# EAGLE schematic PCA9685Shield (EAGLE 7.4.0)
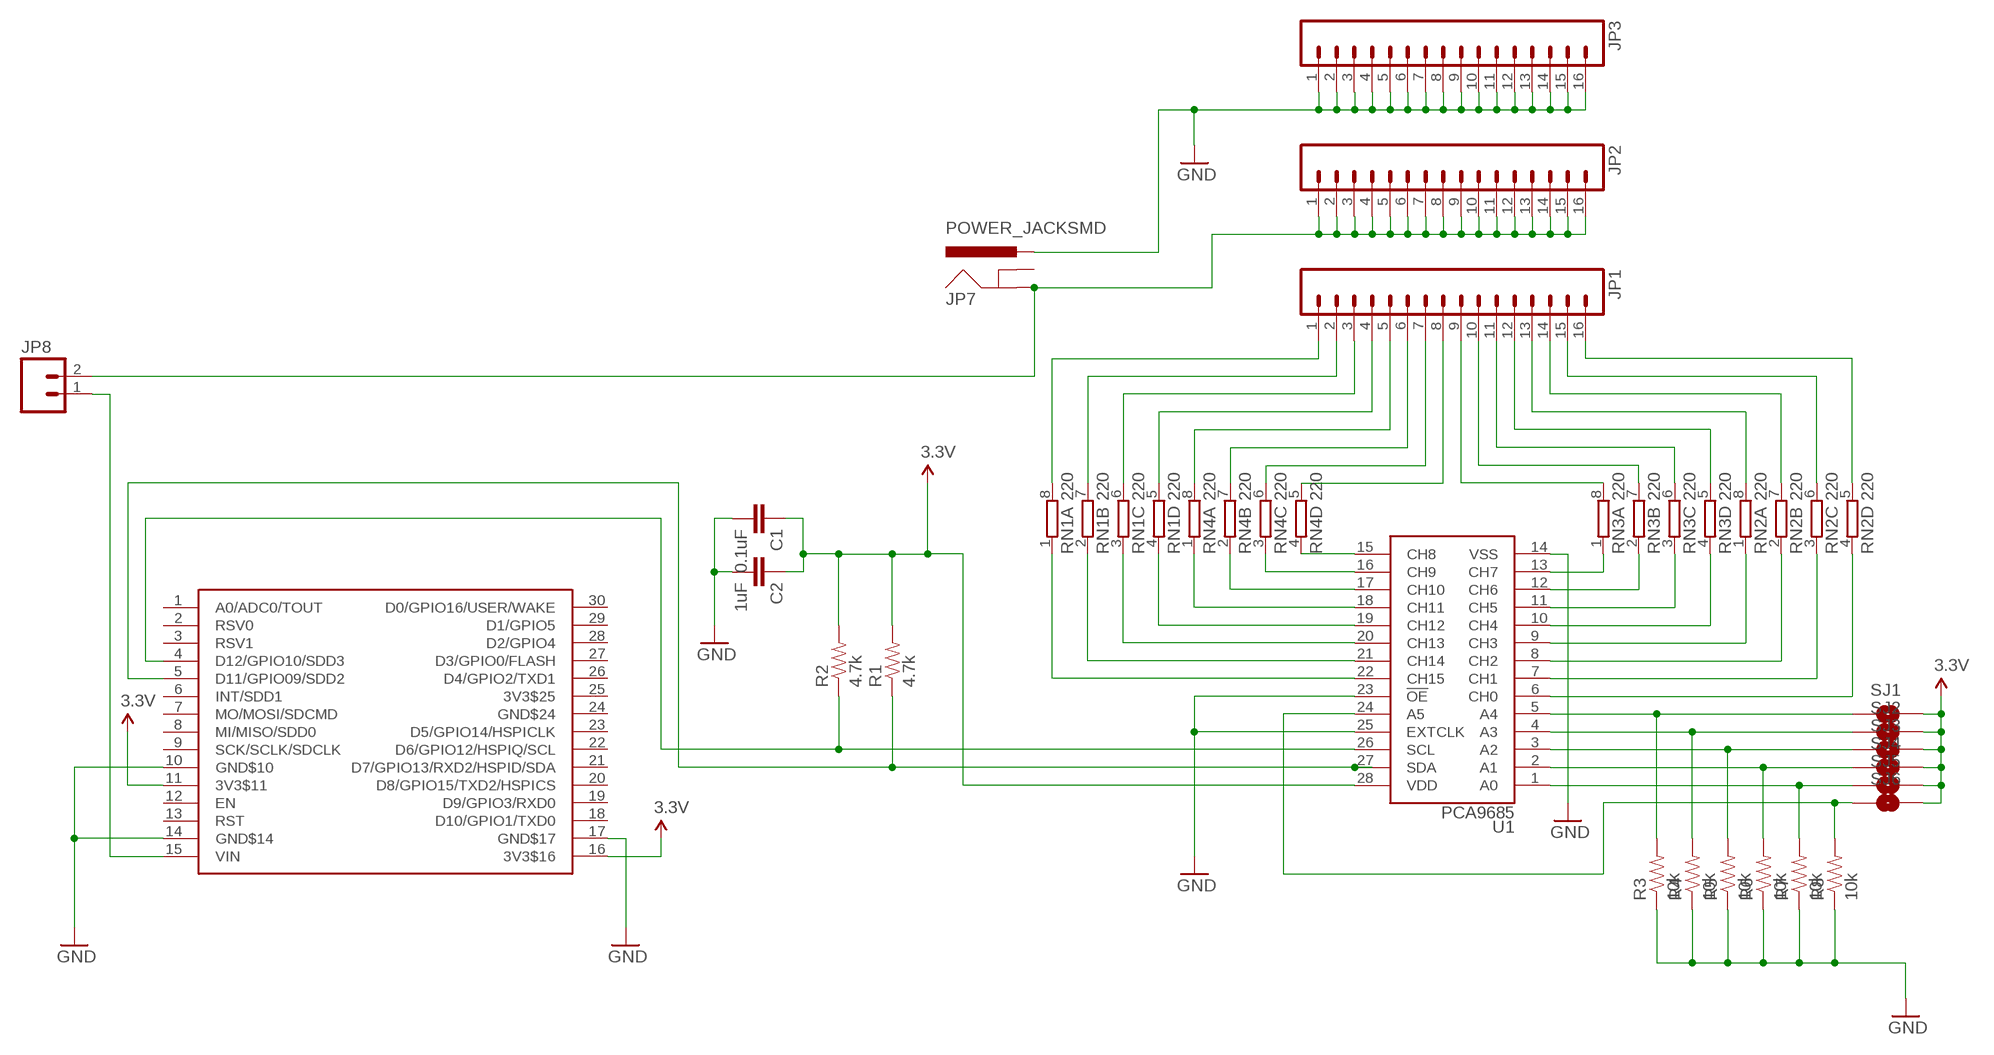
[diagram p0: schematic, sheet 1]

## Parts
C1  0.1uF  CAP0402-CAP  [0402-CAP]
C2  1uF  CAP0402-CAP  [0402-CAP]
JP1  M161X16_NO_SILK  [1X16_NO_SILK]
JP2  M161X16_NO_SILK  [1X16_NO_SILK]
JP3  M161X16_NO_SILK  [1X16_NO_SILK]
JP7  POWER_JACKSMD  [POWER_JACK_SMD]
JP8  M021X02_NO_SILK  [1X02_NO_SILK]
R1  4.7k  RESISTOR0402-RES  [0402-RES]
R2  4.7k  RESISTOR0402-RES  [0402-RES]
R3  10k  RESISTOR0402-RES  [0402-RES]
R4  10k  RESISTOR0402-RES  [0402-RES]
R5  10k  RESISTOR0402-RES  [0402-RES]
R6  10k  RESISTOR0402-RES  [0402-RES]
R7  10k  RESISTOR0402-RES  [0402-RES]
R8  10k  RESISTOR0402-RES  [0402-RES]
RN1  220  4R-NEXBS8V  [EXBS8V]
RN2  220  4R-NEXBS8V  [EXBS8V]
RN3  220  4R-NEXBS8V  [EXBS8V]
RN4  220  4R-NEXBS8V  [EXBS8V]
SJ1  SOLDERJUMPERNO  [SJ_2S-NO]
SJ2  SOLDERJUMPERNO  [SJ_2S-NO]
SJ3  SOLDERJUMPERNO  [SJ_2S-NO]
SJ4  SOLDERJUMPERNO  [SJ_2S-NO]
SJ5  SOLDERJUMPERNO  [SJ_2S-NO]
SJ6  SOLDERJUMPERNO  [SJ_2S-NO]
U1  PCA9685  [TSSOP-28_4MM]
U$1  NERDSHIELD  [NERDUINO_STACK]

## Nets
3.3V: C1.1 C2.1 R1.2 R2.2 SJ1.2 SJ2.2 SJ3.2 SJ4.2 SJ5.2 SJ6.2 U1.28(VDD) U$1.11(3V3$11) U$1.16(3V3$16)
GND: C1.2 C2.2 JP3.1 JP3.2 JP3.3 JP3.4 JP3.5 JP3.6 JP3.7 JP3.8 JP3.9 JP3.10 JP3.11 JP3.12 JP3.13 JP3.14 JP3.15 JP3.16 JP7.VIN0(PWR) R3.1 R4.1 R5.1 R6.1 R7.1 R8.1 U1.14(VSS) U1.23(!OE) U1.25(EXTCLK) U$1.10(GND$10) U$1.14(GND$14) U$1.17(GND$17)
N$1: JP8.1 U$1.15(VIN)
N$2: R1.1 U1.27(SDA) U$1.5(D11/GPIO09/SDD2)
N$3: R7.2 SJ5.1 U1.1(A0)
N$4: R6.2 SJ4.1 U1.2(A1)
N$5: R5.2 SJ3.1 U1.3(A2)
N$6: R4.2 SJ2.1 U1.4(A3)
N$8: R2.1 U1.26(SCL) U$1.4(D12/GPIO10/SDD3)
N$9: R8.2 SJ6.1 U1.24(A5)
N$10: RN2.4 U1.6(CH0)
N$11: JP1.15 RN2.6
N$12: JP1.14 RN2.7
N$13: JP1.13 RN2.8
N$14: JP1.12 RN3.5
N$15: JP1.11 RN3.6
N$16: JP1.10 RN3.7
N$17: JP1.9 RN3.8
N$18: JP1.8 RN4.5
N$19: JP1.7 RN4.6
N$20: JP1.6 RN4.7
N$21: JP1.5 RN4.8
N$22: JP1.4 RN1.5
N$23: JP1.3 RN1.6
N$24: RN1.2 U1.21(CH14)
N$25: RN1.1 U1.22(CH15)
N$26: JP2.1 JP2.2 JP2.3 JP2.4 JP2.5 JP2.6 JP2.7 JP2.8 JP2.9 JP2.10 JP2.11 JP2.12 JP2.13 JP2.14 JP2.15 JP2.16 JP7.P$4(GND) JP8.2
N$27: JP1.2 RN1.7
N$28: JP1.1 RN1.8
N$29: RN1.3 U1.20(CH13)
N$30: RN1.4 U1.19(CH12)
N$31: RN4.1 U1.18(CH11)
N$32: RN4.2 U1.17(CH10)
N$33: RN4.3 U1.16(CH9)
N$34: RN4.4 U1.15(CH8)
N$35: RN3.1 U1.13(CH7)
N$36: RN3.2 U1.12(CH6)
N$37: RN3.3 U1.11(CH5)
N$38: RN3.4 U1.10(CH4)
N$39: RN2.1 U1.9(CH3)
N$40: RN2.2 U1.8(CH2)
N$41: RN2.3 U1.7(CH1)
N$42: JP1.16 RN2.5
N$43: R3.2 SJ1.1 U1.5(A4)
Unconnected: JP7.GND(GNDBREAK) U$1.1(A0/ADC0/TOUT) U$1.2(RSV0) U$1.3(RSV1) U$1.6(INT/SDD1) U$1.7(MO/MOSI/SDCMD) U$1.8(MI/MISO/SDD0) U$1.9(SCK/SCLK/SDCLK) U$1.12(EN) U$1.13(RST) U$1.18(D10/GPIO1/TXD0) U$1.19(D9/GPIO3/RXD0) U$1.20(D8/GPIO15/TXD2/HSPICS) U$1.21(D7/GPIO13/RXD2/HSPID/SDA) U$1.22(D6/GPIO12/HSPIQ/SCL) U$1.23(D5/GPIO14/HSPICLK) U$1.24(GND$24) U$1.25(3V3$25) U$1.26(D4/GPIO2/TXD1) U$1.27(D3/GPIO0/FLASH) U$1.28(D2/GPIO4) U$1.29(D1/GPIO5) U$1.30(D0/GPIO16/USER/WAKE)

## Library data of the parts
C1 C2 = SparkFun:CAP: Capacitor Standard 0603 ceramic capacitor, and 0.1" leaded capacitor.
JP1-JP3 = SparkFun-Connectors:M16: 1x16 .1" header
JP7 = SparkFun:POWER_JACK: Power Jack This is the standard 5.5mm barrel jack for power. The PTH is the most common, proven, reliable, footprint. All others are experimental. The Slot footprint only works if the mill layer is transmitted to the PCB fab house so be warned. Spark Fun Electronics SKU : PRT-00119. Mating wall wart : TOL-00298 (and others)
JP8 = SparkFun:M02: Header 2 Standard 2-pin 0.1" header. Use with straight break away headers (SKU : PRT-00116), right angle break away headers (PRT-00553), swiss pins (PRT-00743), machine pins (PRT-00117), and female headers (PRT-00115). Molex polarized connector foot print use with SKU : PRT-08233 with associated crimp pins and housings.
R1-R8 = SparkFun:RESISTOR: Resistor Basic schematic elements and footprints for 0603, 1206, and PTH resistors.
RN1-RN4 = resistor-dil:4R-N: Array Chip Resistor Source: RS Component / Phycomp; OC_FARNELL: unknown; OC_NEWARK: unknown
SJ1-SJ6 = SparkFun:SOLDERJUMPER: Solder Jumper Standard SMD solder jumper. Used to automate production. Two varients : Normally Open and Normally Closed are the same, but have different paste layers. NC will have a large amount of paste and should jumper during reflow.
U1 = SparkFun-DigitalIC:PCA9685: 16-channel 12-bit PWM I2C interface Internal Oscillator 40Hz to 1kHz Can be totem pole or open collector 2.3V to 5.5V; PROD_ID: IC-12240
U$1 = NerduinoShieldLib:NERDSHIELD